# EAGLE design uLipo (EAGLE 7.4.0)
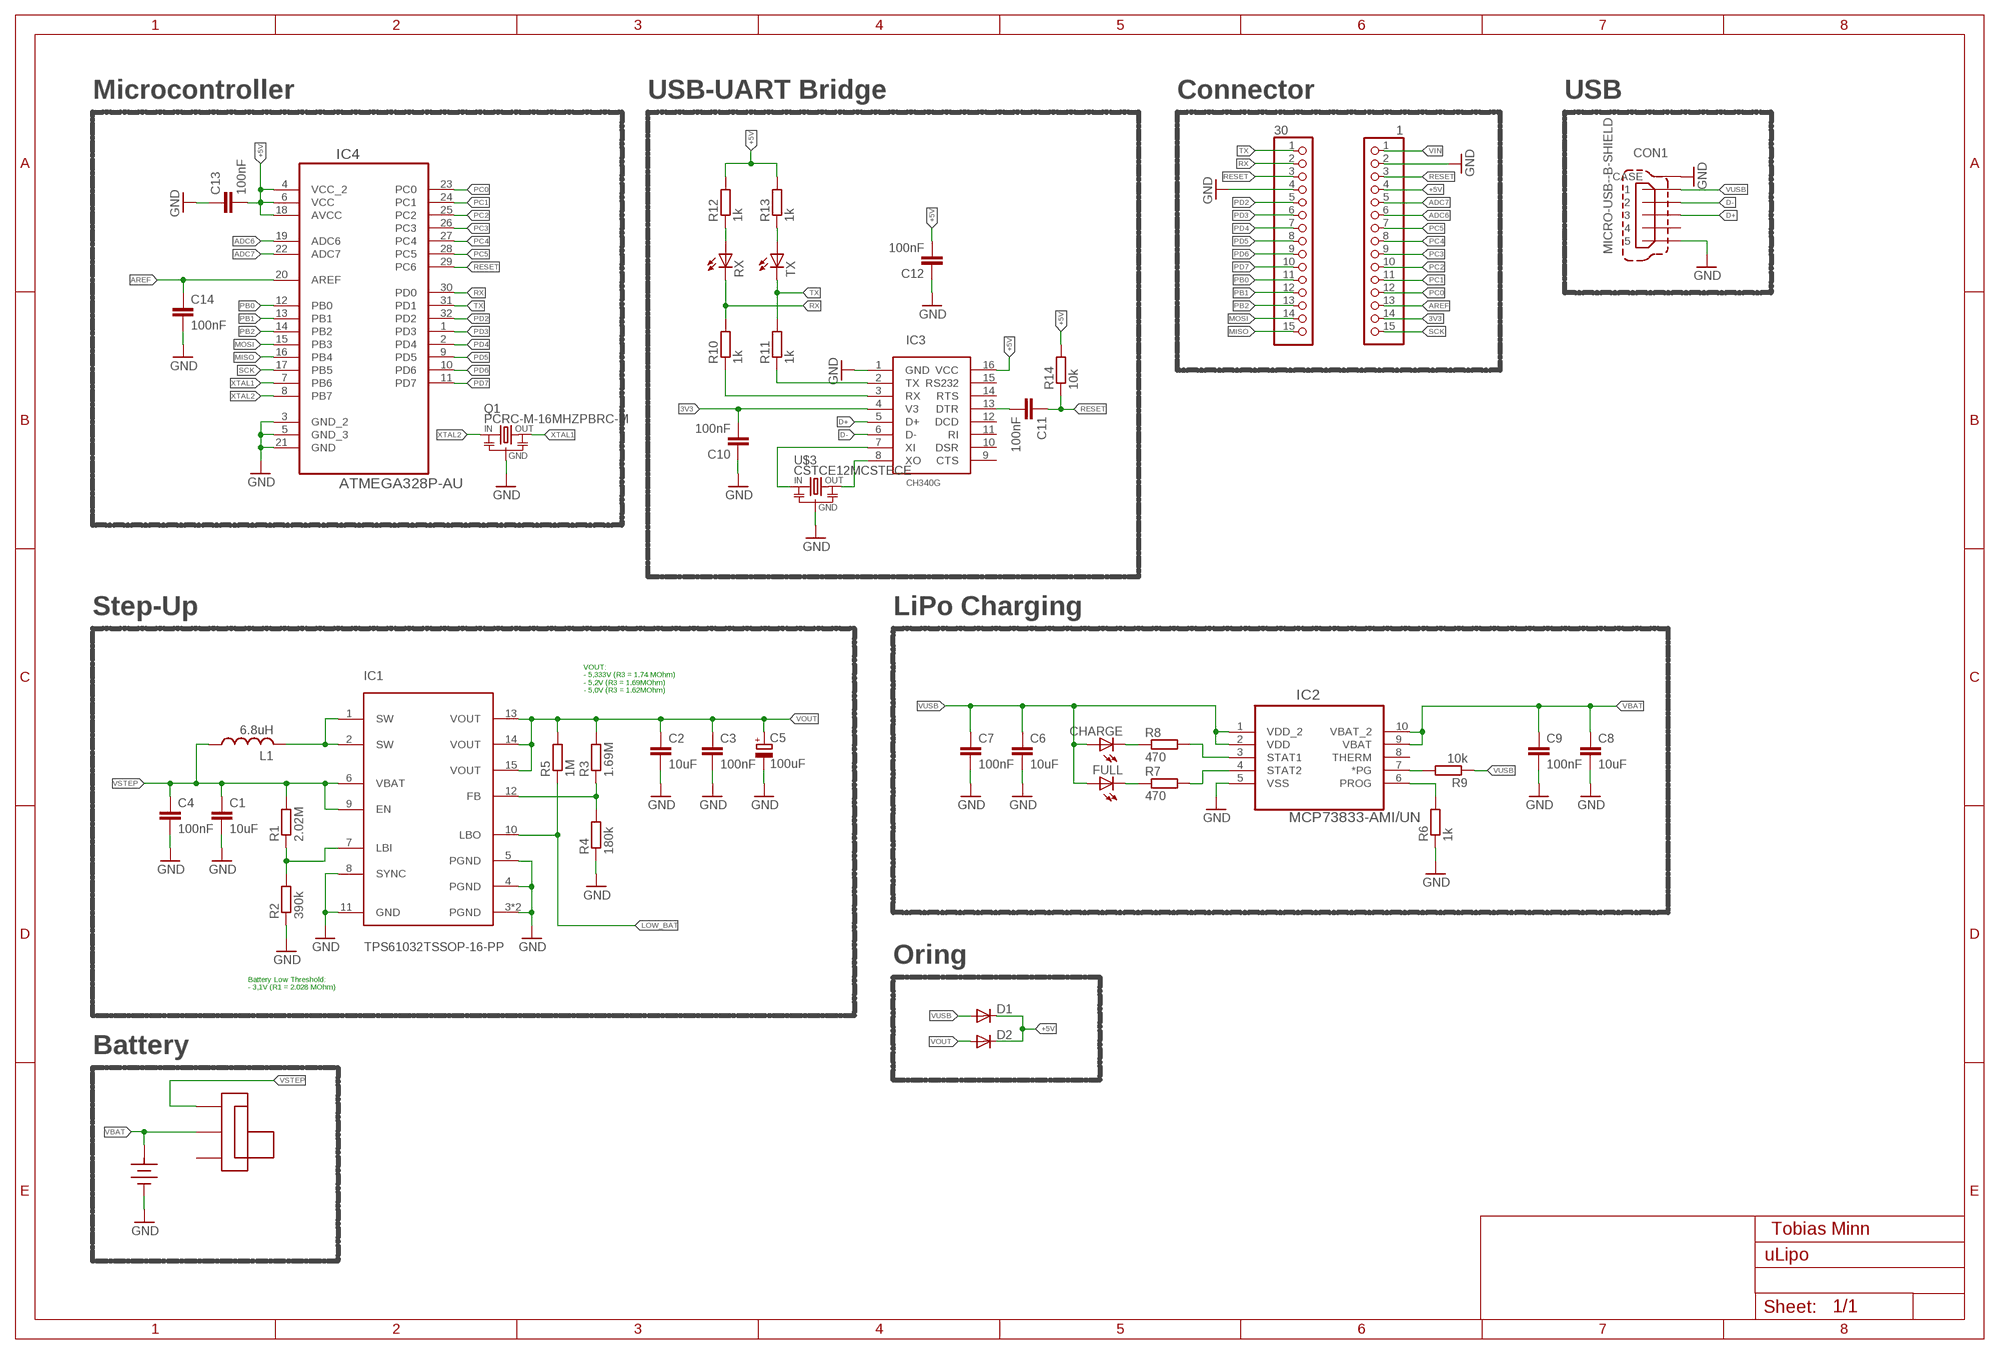
[diagram p0: schematic, sheet 1]

## Parts
1  PINHD-1X15/OCT/BIG  [1X15/OCT/BIG]
30  PINHD-1X15/OCT/BIG  [1X15/OCT/BIG]
BAT  18650BATTERY  [18650BATTERY]
C1  10uF  C-EUC0603K  [C0603K]
C2  10uF  C-EUC0603K  [C0603K]
C3  100nF  C-EUC0603K  [C0603K]
C4  100nF  C-EUC0603K  [C0603K]
C5  100uF  CPOL-EUCT3528  [CT3528]
C6  10uF  C-EUC0603K  [C0603K]
C7  100nF  C-EUC0603K  [C0603K]
C8  10uF  C-EUC0603K  [C0603K]
C9  100nF  C-EUC0603K  [C0603K]
C10  100nF  C-EUC0603K  [C0603K]
C11  100nF  C-EUC0603K  [C0603K]
C12  100nF  C-EUC0603K  [C0603K]
C13  100nF  C-EUC0603K  [C0603K]
C14  100nF  C-EUC0603K  [C0603K]
CHARGE  LEDSML0603  [SML0603]
CON1  MICRO-USB--B-SHIELD  [MOLEX_47346-0001]
D1  DIODE-SOD123  [SOD123]
D2  DIODE-SOD123  [SOD123]
FULL  LEDSML0603  [SML0603]
IC1  TPS61032TSSOP-16-PP  [TSSOP-16-PP]
IC2  MCP73833-AMI/UN  [SOP50P490X110-10N]
IC3  CH340G  [SOIC16]
IC4  ATMEGA328P-AU  [QFP80P900X900X120-32N]
L1  6.8uH  L-USMGV0603  [MGV0603]
Q1  PCRC-M-16MHZPBRC-M  [PBRC-M]
R1  2.02M  R-EU_R0603  [R0603]
R2  390k  R-EU_R0603  [R0603]
R3  1.69M  R-EU_R0603  [R0603]
R4  180k  R-EU_R0603  [R0603]
R5  1M  R-EU_R0603  [R0603]
R6  1k  R-EU_R0603  [R0603]
R7  470  R-EU_R0603  [R0603]
R8  470  R-EU_R0603  [R0603]
R9  10k  R-EU_R0603  [R0603]
R10  1k  R-EU_R0603  [R0603]
R11  1k  R-EU_R0603  [R0603]
R12  1k  R-EU_R0603  [R0603]
R13  1k  R-EU_R0603  [R0603]
R14  10k  R-EU_R0603  [R0603]
RX  LEDCHIP-LED0603  [CHIP-LED0603]
TX  LEDCHIP-LED0603  [CHIP-LED0603]
U$2  SWITCH  [SWITCH]
U$3  CSTCE12MCSTECE  [CSTCE12M]

## Nets
3V3: 1.14 C10.2 IC3.4(V3)
+5V: 1.4 C12.2 C13.2 D1.C D2.C IC3.16(VCC) IC4.4(VCC_2) IC4.6(VCC) IC4.18(AVCC) R12.2 R13.2 R14.2
ADC6: 1.6 IC4.19(ADC6)
ADC7: 1.5 IC4.22(ADC7)
AREF: 1.13 C14.1 IC4.20(AREF)
D+: CON1.3 IC3.5(D+)
D-: CON1.2 IC3.6(D-)
GND: 1.2 30.4 BAT.P$2(P2) C1.2 C2.2 C3.2 C4.2 C5.- C6.2 C7.2 C8.2 C9.2 C10.1 C12.1 C13.1 C14.2 CON1.5 CON1.M1(CASE) CON1.M2(CASE) CON1.M3(CASE) CON1.M4(CASE) CON1.M5(CASE) CON1.M6(CASE) IC1.3(PGND) IC1.4(PGND) IC1.5(PGND) IC1.8(SYNC) IC1.11(GND) IC1.17(PGND) IC2.5(VSS) IC3.1(GND) IC4.3(GND_2) IC4.5(GND_3) IC4.21(GND) Q1.2(GND) R2.1 R4.1 R6.1 U$3.2(GND)
LOW_BAT: IC1.10(LBO) R5.1
MISO: 30.15 IC4.16(PB4)
MOSI: 30.14 IC4.15(PB3)
N$1: IC1.1(SW) IC1.2(SW) L1.P$2
N$2: IC2.4(STAT2) R7.2
N$3: IC1.12(FB) R3.1 R4.2
N$4: IC2.3(STAT1) R8.2
N$5: IC1.7(LBI) R1.1 R2.2
N$6: CHARGE.C R8.1
N$7: FULL.C R7.1
N$8: IC2.7(*PG) R9.2
N$9: IC2.6(PROG) R6.2
N$10: IC3.2(TX) R11.1
N$11: IC3.3(RX) R10.1
N$12: R12.1 RX.A
N$13: R13.1 TX.A
N$14: IC3.7(XI) U$3.1(IN)
N$15: IC3.8(XO) U$3.3(OUT)
N$16: C11.2 IC3.13(DTR)
PB0: 30.11 IC4.12(PB0)
PB1: 30.12 IC4.13(PB1)
PB2: 30.13 IC4.14(PB2)
PC0: 1.12 IC4.23(PC0)
PC1: 1.11 IC4.24(PC1)
PC2: 1.10 IC4.25(PC2)
PC3: 1.9 IC4.26(PC3)
PC4: 1.8 IC4.27(PC4)
PC5: 1.7 IC4.28(PC5)
PD2: 30.5 IC4.32(PD2)
PD3: 30.6 IC4.1(PD3)
PD4: 30.7 IC4.2(PD4)
PD5: 30.8 IC4.9(PD5)
PD6: 30.9 IC4.10(PD6)
PD7: 30.10 IC4.11(PD7)
RESET: 1.3 30.3 C11.1 IC4.29(PC6) R14.1
RX: 30.2 IC4.30(PD0) R10.2 RX.C
SCK: 1.15 IC4.17(PB5)
TX: 30.1 IC4.31(PD1) R11.2 TX.C
VBAT: BAT.P$1(P1) C8.1 C9.1 IC2.9(VBAT) IC2.10(VBAT_2) U$2.P$1
VIN: 1.1
VOUT: C2.1 C3.1 C5.+ D2.A IC1.13(VOUT) IC1.14(VOUT) IC1.15(VOUT) R3.2 R5.2
VSTEP: C1.1 C4.1 IC1.6(VBAT) IC1.9(EN) L1.P$1 R1.2 U$2.P$2
VUSB: C6.1 C7.1 CHARGE.A CON1.1 D1.A FULL.A IC2.1(VDD_2) IC2.2(VDD) R9.1
XTAL1: IC4.7(PB6) Q1.3(OUT)
XTAL2: IC4.8(PB7) Q1.1(IN)
Unconnected: CON1.4 IC2.8(THERM) IC3.9(CTS) IC3.10(DSR) IC3.11(RI) IC3.12(DCD) IC3.14(RTS) IC3.15(RS232) U$2.P$3

## Notes on the sheet
- Microcontroller | USB-UART Bridge | Connector | USB
- Step-Up | LiPo Charging
- VOUT:
  - 5,333V (R3 = 1.74 MOhm)
  - 5,2V (R3 = 1.69MOhm)
  - 5,0V (R3 = 1.62MOhm)
- Oring
- Battery Low Threshold:
  - 3,1V (R1 = 2.028 MOhm)
- Battery
- Tobias Minn

## Library data of the parts
1 30 = pinhead_v2:PINHD-1X15: PIN HEADER
BAT = TM-con:18650BATTERY
C1-C4 C6-C14 = rcl:C-EU: CAPACITOR, European symbol
C5 = rcl:CPOL-EU: POLARIZED CAPACITOR, European symbol
CHARGE FULL RX TX = led:LED: LED OSRAM: - CHIPLED LG R971, LG N971, LY N971, LG Q971, LY Q971, LO R971, LY R971 LH N974, LH R974 LS Q976, LO Q976, LY Q976 LO Q996 - Hyper CHIPLED LW Q18S LB Q993, LB Q99A, LB R99A - SideLED LS A670, LO A670, LY A670, LG A670, LP A670 LB A673, LV A673, LT A673, LW A673 LH A674 LY A675 LS A676, LA A676, LO A676, LY A676, LW A676 LS A679, LY A679, LG A679 - Hyper Micro SIDELED® LS Y876, LA Y876, LO Y876, LY Y876 LT Y87S - SmartLED LW L88C, LW L88S LB L89C, LB L89S, LG L890 LS L89K, LO L89K, LY L89K LS L896, LA L896, LO L896, LY L896 - TOPLED LS T670, LO T670, LY T670, LG T670, LP T670 LSG T670, LSP T670, LSY T670, LOP T670, LYG T670 LG T671, LOG T671, LSG T671 LB T673, LV T673, LT T673, LW T673 LH T674 LS T676, LA T676, LO T676, LY T676, LB T676, LH T676, LSB T676, LW T676 LB T67C, LV T67C, LT T67C, LS T67K, LO T67K, LY T67K, LW E67C LS E67B, LA E67B, LO E67B, LY E67B, LB E67C, LV E67C, LT E67C LW T67C LS T679, LY T679, LG T679 LS T770, LO T770, LY T770, LG T770, LP T770 LB T773, LV T773, LT T773, LW T773 LH T774 LS E675, LA E675, LY E675, LS T675 LS T776, LA T776, LO T776, LY T776, LB T776 LHGB T686 LT T68C, LB T68C - Hyper Mini TOPLED® LB M676 - Mini TOPLED Santana® LG M470 LS M47K, LO M47K, LY M47K Source: http://www.osram.convergy.de LUXEON: - LUMILED® LXK2-PW12-R00, LXK2-PW12-S00, LXK2-PW14-U00, LXK2-PW14-V00 LXK2-PM12-R00, LXK2-PM12-S00, LXK2-PM14-U00 LXK2-PE12-Q00, LXK2-PE12-R00, LXK2-PE12-S00, LXK2-PE14-T00, LXK2-PE14-U00 LXK2-PB12-K00, LXK2-PB12-L00, LXK2-PB12-M00, LXK2-PB14-N00, LXK2-PB14-P00, LXK2-PB14-Q00 LXK2-PR12-L00, LXK2-PR12-M00, LXK2-PR14-Q00, LXK2-PR14-R00 LXK2-PD12-Q00, LXK2-PD12-R00, LXK2-PD12-S00 LXK2-PH12-R00, LXK2-PH12-S00 LXK2-PL12-P00, LXK2-PL12-Q00, LXK2-PL12-R00 Source: www.luxeon.com KINGBRIGHT: KA-3528ASYC Source: www.kingbright.com
CON1 = MK_connector:MICRO-USB-; OC_FARNELL: 1568026; SUPPLIER: MOLEX
D1 D2 = diode:DIODE-: DIODE
IC1 = TM-power:TPS61032
IC2 = TM-power:MCP73833-AMI/UN: IC, BATTERY CHARGER, 1A; MPN: MCP73833-AMI/UN; OC_FARNELL: 1332160; OC_NEWARK: 88K5664; PACKAGE: MSOP-10; SUPPLIER: Microchip
IC3 = TM-misc:CH340G
IC4 = AtmelMC:ATMEGA328P-AU: 8-bit Microcontroller with In-System Programmable Flash; MPN: ATMEGA328P-AU; OC_FARNELL: 1715486; OC_NEWARK: 14R4631; PACKAGE: TQFP-32; SUPPLIER: Atmel
L1 = TM-passives:L-US: INDUCTOR, American symbol
Q1 = TM-misc:PCRC-M-16MHZ
R1-R14 = rcl:R-EU_: RESISTOR, European symbol
U$2 = TM-misc:SWITCH
U$3 = TM-misc:CSTCE12M

## Board
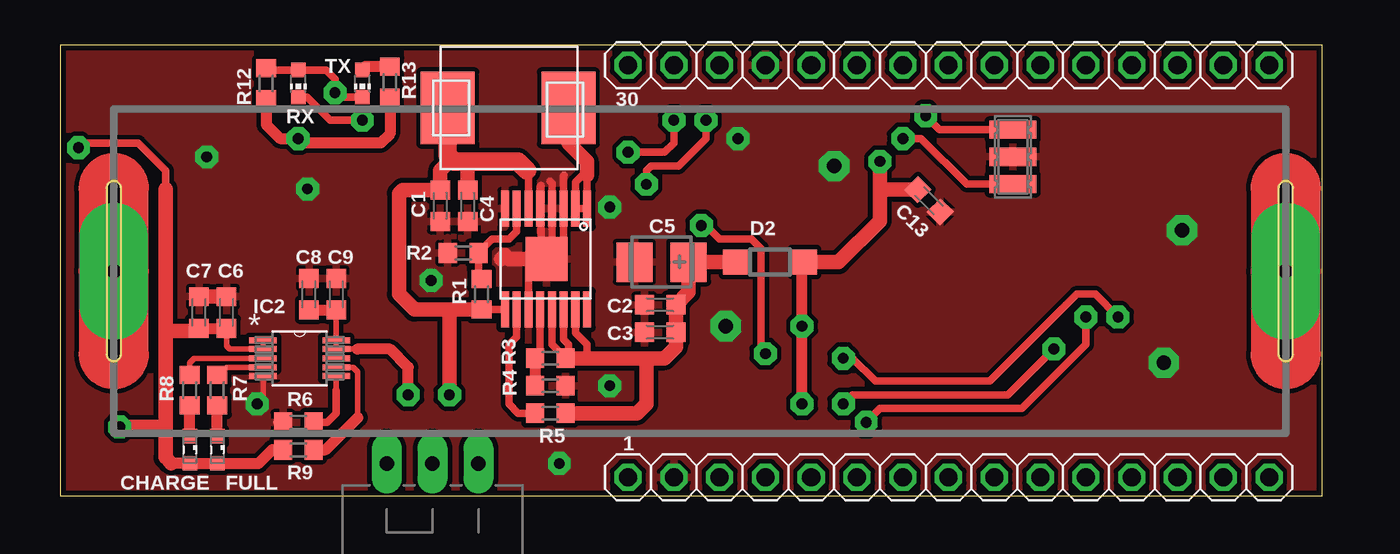
[diagram p1: board, top side]
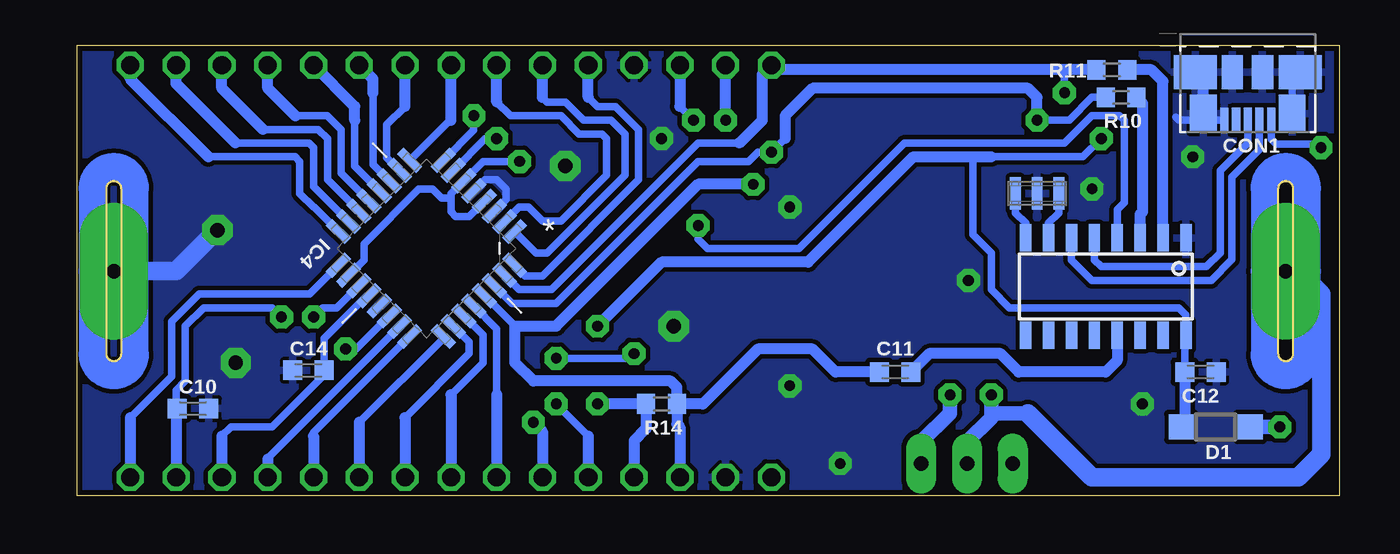
[diagram p2: board, bottom side, seen from below]

Size 70 x 25 mm. Coordinates in mm from the lower left corner, seen from the top.
Outline: 0,0 70,0 70,25 0,25 0,0
Copper layers (1*16): Top 0.035mm / dielectric 1.5mm / Bottom 0.035mm
Design rules "PCB-POOL Standard_editM": minimum track width 0.15mm, minimum drill 0.3mm, track to track 0.15mm, track to pad 0.15mm, pad to pad 0.15mm, via to via 0.15mm, smd to smd 0.15mm, copper to edge 0.3mm, drill to drill 0.2mm, minimum pad ring 0.2mm, minimum via ring 0.15mm, stop-mask expansion 0.075mm, vias tented up to drill 0mil, thermal gap 0.2mm

### Footprints (pad centres in the part's own frame; a part is rotated, then mirrored left to right if it is on the bottom)
1X15/OCT/BIG = drill 1 pad 1.5 octagon: 1 -17.78,0; 2 -15.24,0; 3 -12.7,0; 4 -10.16,0; 5 -7.62,0; 6 -5.08,0; 7 -2.54,0; 8 0,0; 9 2.54,0; 10 5.08,0; 11 7.62,0; 12 10.16,0; 13 12.7,0; 14 15.24,0; 15 17.78,0
18650BATTERY = drill 0.8 pad 3.81 long: P$1 0,0; P$2 65,0
C0603K = smd 1.05 x 1.08: 1 -0.875,0; 2 0.875,0
CT3528 = smd 2 x 2.2: + -1.5,0; - 1.5,0
SML0603 = smd 0.8 x 0.8: A 0.75,0; C -0.75,0
MOLEX_47346-0001 = smd 0.45 x 1.38: 1 -1.3,0; 2 -0.65,0; 3 0,0; 4 0.65,0; 5 1.3,0 | smd 1.475 x 2.1: M1 -2.462,-0.36; M2 2.462,-0.36 | smd 2.375 x 1.9: M3 -2.913,-2.66; M6 2.913,-2.66 | smd 1.175 x 1.9: M4 -0.82,-2.66; M5 0.85,-2.66
SOD123 = smd 1.4 x 1.4: A 1.9,0; C -1.9,0
TSSOP-16-PP = smd 0.45 x 2: 1 -2.3,-2.8; 2 -1.65,-2.8; 3 -1,-2.8; 4 -0.35,-2.8; 5 0.3,-2.8; 6 0.95,-2.8; 7 1.6,-2.8; 8 2.25,-2.8; 9 2.25,2.8; 10 1.6,2.8; 11 0.95,2.8; 12 0.3,2.8; 13 -0.35,2.8; 14 -1,2.8; 15 -1.65,2.8; 16 -2.3,2.8 | smd 2.31 x 2.46: 17 -0.05,0
SOP50P490X110-10N = smd 1.524 x 0.33: 1 -2.032,0.991; 2 -2.032,0.508; 3 -2.032,0; 4 -2.032,-0.508; 5 -2.032,-0.991; 6 2.032,-0.991; 7 2.032,-0.508; 8 2.032,0; 9 2.032,0.508; 10 2.032,0.991
SOIC16 = smd 0.635 x 1.524: 1 -4.445,-2.695; 2 -3.175,-2.695; 3 -1.905,-2.695; 4 -0.635,-2.695; 5 0.635,-2.695; 6 1.905,-2.695; 7 3.175,-2.695; 8 4.445,-2.695; 9 4.445,2.695; 10 3.175,2.695; 11 1.905,2.695; 12 0.635,2.695; 13 -0.635,2.695; 14 -1.905,2.695; 15 -3.175,2.695; 16 -4.445,2.695
QFP80P900X900X120-32N = smd 1.473 x 0.508: 1 -4.115,2.794; 2 -4.115,2.007; 3 -4.115,1.194; 4 -4.115,0.406; 5 -4.115,-0.406; 6 -4.115,-1.194; 7 -4.115,-2.007; 8 -4.115,-2.794; 17 4.115,-2.794; 18 4.115,-2.007; 19 4.115,-1.194; 20 4.115,-0.406; 21 4.115,0.406; 22 4.115,1.194; 23 4.115,2.007; 24 4.115,2.794 | smd 0.508 x 1.473: 9 -2.794,-4.115; 10 -2.007,-4.115; 11 -1.194,-4.115; 12 -0.406,-4.115; 13 0.406,-4.115; 14 1.194,-4.115; 15 2.007,-4.115; 16 2.794,-4.115; 25 2.794,4.115; 26 2.007,4.115; 27 1.194,4.115; 28 0.406,4.115; 29 -0.406,4.115; 30 -1.194,4.115; 31 -2.007,4.115; 32 -2.794,4.115
MGV0603 = smd 3 x 4: P$1 -3.4,0; P$2 3.3,0
PBRC-M = smd 1 x 2.6: 1 -1.5,0; 2 0,0; 3 1.5,0
R0603 = smd 1 x 1.1: 1 -0.85,0; 2 0.85,0
CHIP-LED0603 = smd 0.8 x 0.8: A 0,-0.75; C 0,0.75
SWITCH = drill 0.8 pad 1.676 long: P$1 0,0; P$2 -2.54,0; P$3 2.54,0
CSTCE12M = smd 0.6 x 1.8: 1 -1.2,0; 2 0,0; 3 1.2,0

### Placement (x,y rotation side)
1  49.27,1.02 0 top
30  49.27,23.88 0 top
BAT  2.97,12.45 0 top
C1  21.07,16.08 270 top
C2  33.27,10.59 180 top
C3  33.27,9.06 180 top
C4  22.6,16.08 270 top
C5  33.35,12.95 180 top
C6  9.22,10.16 90 top
C7  7.69,10.16 90 top
C8  13.79,11.18 90 top
C9  15.31,11.18 90 top
C10  63.57,4.83 180 bottom
C11  24.63,6.86 0 bottom
C12  7.69,6.86 180 bottom
C13  48.18,16.36 135 top
C14  57.17,6.95 180 bottom
CHARGE  7.18,2.54 270 top
CON1  5.07,20.83 180 bottom
D1  6.85,3.81 0 bottom
D2  39.36,12.95 180 top
FULL  8.71,2.54 270 top
IC1  26.92,13.13 180 top
IC2  13.28,7.62 0 top
IC3  12.95,11.6 180 bottom
IC4  50.62,13.72 225 bottom
L1  24.88,21.51 0 top
Q1  52.82,18.8 270 top
R1  23.36,11.18 270 top
R2  22.34,13.46 0 top
R3  27.17,7.62 0 top
R4  27.17,6.1 180 top
R5  27.17,4.57 0 top
R6  13.2,4.06 0 top
R7  8.71,5.84 90 top
R8  7.18,5.84 90 top
R9  13.2,2.54 0 top
R10  12.1,22.1 180 bottom
R11  12.61,23.62 180 bottom
R12  11.42,22.86 270 top
R13  18.28,22.94 270 top
R14  37.58,5.08 180 bottom
RX  13.2,22.86 180 top
TX  16.76,22.86 180 top
U$2  20.65,1.78 180 top
U$3  16.76,16.76 180 bottom

### Tracks (layer width: path | path; a pad name or v marks a point on that pad's centre or on a via)
3V3  (via drill 0.6 pad 1.27)
  Top 0.406: v35.55,14.99 35.81,14.99 36.57,14.22 38.35,14.22 38.85,13.72 38.85,8.13 v39.11,7.87 | v43.43,7.62 43.93,7.62 45.2,6.35 51.55,6.35 56.38,11.18 57.4,11.18 v58.67,9.91
  Bottom 0.406: v35.55,14.99 35.55,14.22 35.04,13.72 29.96,13.72 24.12,19.56 15.23,19.56 13.71,21.08 12.18,21.08 11.93,20.83 11.93,16.26 12.31,15.88 IC3.4 | v39.11,7.87 39.36,7.62 v43.43,7.62 | v58.67,9.91 59.17,10.41 62.98,10.41 64,9.4 64,6.35 64.51,5.84 64.51,4.89 C10.2
  Bottom 0.61: C10.2 64.51,4.76 1.14
+5V  (via drill 0.6 pad 1.27)
  Top 0.61: D2.C 41.14,12.83 v41.14,9.4 v41.14,5.08 | R12.2 11.42,20.57 12.18,19.81 v13.2,19.81 13.45,19.56 17.77,19.56 18.28,20.07 R13.2
  Top 0.813: D2.C 43.17,12.95 45.46,15.24 45.46,16.76 | 45.46,16.76 v45.46,18.54 | 45.46,16.76 45.67,16.97 C13.2
  Bottom 0.406: 49.27,16.51 49.27,16.75 IC4.6 47.49,18.54 v45.46,18.54 | 49.27,16.51 49.27,15.75 49.01,15.49 48.27,15.49 IC4.4 | IC4.18 54.09,13.08 54.09,13.97 51.05,17.02 50.28,17.02 49.78,16.51 49.27,16.51 | C12.2 8.57,8.84 IC3.16 8.5,10.03 8.88,10.41 18.28,10.41 19.3,11.43 19.3,13.46 20.31,14.48 20.31,18.8 | v13.2,19.81 14.22,18.8 19.3,18.8
  Bottom 0.61: C12.2 8.57,3.88 8.68,3.88 D1.C | v41.14,5.08 R14.2 38.43,3.72 39.11,3.05 1.4 | v41.14,9.4 37.58,12.95 29.46,12.95 23.61,18.8 20.31,18.8 19.3,18.8
ADC6  (via drill 0.6 pad 1.27)
  Top 0.406: v56.89,9.91 56.89,8.38 53.33,4.83 45.46,4.83 v44.7,4.06
  Bottom 0.406: IC4.19 55.61,10.41 56.38,10.41 v56.89,9.91
  Bottom 0.61: v44.7,4.06 44.19,3.56 1.6
ADC7  (via drill 0.6 pad 1.27)
  Top 0.406: v55.11,8.13 52.57,5.59 43.93,5.59 v43.43,5.08
  Bottom 0.406: IC4.22 54.52,8.13 v55.11,8.13 | 41.65,3.3 v43.43,5.08
  Bottom 0.61: 41.65,3.3 1.5
AREF
  Bottom 0.406: 61.97,3.3 61.46,3.81 59.17,3.81 56.29,6.69 C14.1 56.29,8.72 53.92,11.09 IC4.20
  Bottom 0.61: 61.97,3.3 1.13
D+
  Bottom 0.406: CON1.3 5.07,19.56 6.6,18.03 6.6,13.46 7.36,12.7 13.2,12.7 13.58,13.08 IC3.5
D-
  Bottom 0.406: CON1.2 4.42,19.19 5.95,17.67 5.95,13.1 7.1,11.94 13.71,11.94 14.85,13.08 IC3.6
GND  (via drill 0.6 pad 1.27, 0.8 pad 1.68)
  Top 0.305: IC2.5 11.25,5.41 v10.91,5.08
  Top 0.406: 27.27,13.13 IC1.17 | 27.92,13.13 IC1.17 | 26.62,13.13 IC1.17 | 24.67,13.35 24.88,13.13 | 12.01,4.06 R6.1 | IC1.11 25.97,12.69 26.41,13.13 | 27.17,17.45 27.27,17.35 IC1.4 27.27,13.43 IC1.17 | IC1.5 26.62,17.15 26.66,17.19 26.66,13.43 IC1.17 | IC1.17 27.92,14.08 27.92,15.99 27.93,16 | IC1.3 27.92,17.76 27.93,17.78
  Top 0.813: 24.88,13.13 26.41,13.13 IC1.17 | 24.45,13.13 24.67,13.35 | C6.2 C7.2
  Bottom 0.406: IC4.5 47.38,17.53 46.73,17.53 46.22,17.02 46.22,16.43 IC4.3 | CON1.5 8.88,20.83 9.06,21 | CON1.M1 2.61,23.04 CON1.M3
  Bottom 0.61: CON1.M2 7.54,23.04 CON1.M6
  Bottom 1.016: BAT.P$2 64.5,12.45 v62.22,14.73
  other vias: 36.9,9.4 61.21,7.37 42.92,18.29 8.12,18.8 27.68,1.78 20.57,11.94 30.47,6.1 30.47,16 37.58,19.81 13.71,17.02
  pour Bottom (isolate 0.254): 70,0 0,0 0,25 70,25
  pour Top (isolate 0.254): 0,0 70,0 70,25 0,25
LOW_BAT
  Top 0.406: IC1.10 25.32,8.81 24.88,8.38 24.88,5.08 25.39,4.57 R5.1
MISO
  Bottom 0.406: IC4.16 56.85,16 56.89,16 57.65,16.76 57.65,18.54 57.9,18.8 62.73,18.8
  Bottom 0.61: 62.73,18.8 67.05,23.11 30.15
MOSI
  Bottom 0.406: IC4.15 56.89,17.15 56.89,19.3 57.14,19.56 61.21,19.56
  Bottom 0.61: 61.21,19.56 64.51,22.86 30.14
N$1
  Top 0.406: 29.2,17.78 29.22,17.77 IC1.1 IC1.2 28.57,17.4 29.2,18.03
  Top 0.813: L1.P$2 28.18,19.56 29.2,18.54 29.2,18.03 29.2,17.78
N$2
  Top 0.305: IC2.4 9.22,7.11 8.96,6.86 8.87,6.86 R7.2
N$3
  Top 0.406: 26.11,7.83 R3.1 26.62,7.92 IC1.12
  Top 0.61: R3.1 R4.2
N$4
  Top 0.305: IC2.3 7.44,7.62 7.18,7.37 R8.2
N$5
  Top 0.406: IC1.7 25.32,14.66 24.88,14.22 23.96,14.22 R2.2 23.19,12.19 R1.1
N$6
  Top 0.61: CHARGE.C R8.1
N$7
  Top 0.61: FULL.C R7.1
N$8
  Top 0.305: IC2.7 16.25,7.11 16.5,6.86 16.5,4.32
  Top 0.61: R9.2 14.72,2.54 16.5,4.32
N$9
  Top 0.305: IC2.6 15.31,5.84
  Top 0.406: 15.31,5.84 15.31,4.57 14.8,4.06 R6.2
N$10
  Bottom 0.61: IC3.2 9.77,22.99 10.41,23.62 R11.1
N$11
  Bottom 0.61: 11.17,22.1 R10.1 10.91,21.76 10.91,15.75 11.04,15.62 IC3.3
N$12
  Top 0.406: 15.23,22.35 15.23,23.11 14.74,23.61 RX.A 11.52,23.61 R12.1
N$13
  Top 0.61: R13.1 16.86,23.79 16.76,23.69 TX.A
N$14
  Bottom 0.406: IC3.7 16.12,15.11 15.56,15.68 U$3.1
N$15
  Bottom 0.406: IC3.8 17.39,15.11 17.96,15.68 U$3.3
N$16
  Bottom 0.61: IC3.13 12.31,7.49 12.95,6.86 17.77,6.86 18.79,7.87 22.74,7.87 C11.2
PB0
  Bottom 0.406: IC4.12 54.61,18.29 54.6,18.3 54.6,20.83
  Bottom 0.61: 54.6,20.83 54.6,21.59 30.11
PB1
  Bottom 0.406: 57.9,21.08 56.13,21.08 55.36,20.32 55.36,17.89 IC4.13
  Bottom 0.61: 57.9,21.08 59.43,22.61 30.12
PB2
  Bottom 0.406: IC4.14 56.12,17.53 56.12,19.8 56.63,20.32 59.68,20.32
  Bottom 0.61: 59.68,20.32 61.97,22.61 30.13
PC0
  Bottom 0.406: IC4.23 59.43,2.07 59.43,2.03
  Bottom 0.61: 59.43,2.03 1.12
PC1
  Bottom 0.406: IC4.24 56.89,3.5 56.89,3.3
  Bottom 0.61: 56.89,3.3 1.11
PC2
  Bottom 0.406: IC4.25 49.68,8.73 54.35,4.06
  Bottom 0.61: 54.35,4.06 1.10
PC3
  Bottom 0.406: IC4.26 48.25,8.51 48.25,7.87 51.81,4.32
  Bottom 0.61: 51.81,4.32 1.9
PC4
  Bottom 0.406: IC4.27 47.49,8.9 47.49,7.37 49.27,5.59
  Bottom 0.61: 49.27,5.59 1.8
PC5
  Bottom 0.406: 46.73,5.59 46.73,9.25 IC4.28
  Bottom 0.61: 46.73,5.59 1.7
PD2
  Bottom 0.406: IC4.32 45.14,12.19 44.19,12.19 38.85,17.53 38.85,20.32 40.12,21.59 41.14,21.59 41.65,22.1
  Bottom 0.61: 41.65,22.1 30.5
PD3
  Bottom 0.406: IC4.1 44.54,13.46 43.93,13.46 39.62,17.78 39.62,20.07 40.38,20.83 41.9,20.83 42.92,21.84 43.93,21.84 44.19,22.1
  Bottom 0.61: 44.19,22.1 30.6
PD4
  Bottom 0.406: IC4.2 45.49,16 44.95,16 44.19,15.24 43.17,15.24 40.63,17.78 40.63,19.81 40.89,20.07 42.16,20.07 43.17,21.08 45.97,21.08 46.73,21.84
  Bottom 0.61: 46.73,21.84 30.7
PD5
  Bottom 0.406: IC4.9 49.32,20.83 49.27,20.83
  Bottom 0.61: 49.27,20.83 30.8
PD6
  Bottom 0.406: IC4.10 52.82,18.76 52.82,20.57 51.81,21.59
  Bottom 0.61: 51.81,21.59 30.9
PD7
  Bottom 0.406: IC4.11 53.59,18.37 53.59,22.35
  Bottom 0.61: 53.59,22.35 53.59,23.11 30.10
RESET  (via drill 0.6 pad 1.27)
  Top 0.406: v32.5,17.27 32.5,18.03 32.76,18.29 34.28,18.29 35.81,19.81 v35.81,20.83
  Bottom 0.406: 36.57,21.59 v35.81,20.83 | IC4.29 47.41,11.09 45.71,9.4
  Bottom 0.61: 36.57,4.91 R14.1 | R14.1 36.73,6.01 37.08,6.35 44.7,6.35 45.71,7.37 45.71,9.4 43.43,9.4 35.55,17.27 v32.5,17.27 | C11.1 27.93,6.86 29.2,8.13 32.25,8.13 35.3,5.08 R14.1 | R14.1 36.73,3.98 36.57,3.81 1.3 | 30.3 36.57,21.59
RX  (via drill 0.6 pad 1.27)
  Top 0.406: v31.49,19.05 33.52,19.05 34.03,19.56 v34.03,20.83 | v16.76,20.83 14.98,20.83 13.7,22.11 RX.C
  Bottom 0.406: IC4.30 45.88,10.67 43.43,10.67 35.55,18.54 32.76,18.54 32.25,19.05 v31.49,19.05 30.73,19.81 | R10.2 13.71,22.1 14.98,20.83 v16.76,20.83
  Bottom 0.61: v16.76,20.83 16.76,22.1 17.26,22.61 29.2,22.61 30.73,21.08 30.73,19.81 | v34.03,20.83 30.2
SCK
  Bottom 0.406: IC4.17 57.11,11.18 63.24,11.18 64.76,9.65 64.76,6.6 67.05,4.32
  Bottom 0.61: 67.05,4.32 1.15
TX  (via drill 0.6 pad 1.27)
  Top 0.406: TX.C 15.47,22.11 v15.23,22.35
  Bottom 0.406: IC4.31 45.49,11.43 43.68,11.43 35.55,19.56 33.27,19.56 | v15.23,22.35 15.23,23.62
  Bottom 0.61: R11.2 15.23,23.62 31.23,23.62 30.1 32,23.37 32,20.83 33.27,19.56
VBAT  (via drill 0.6 pad 1.27)
  Top 0.305: 16.47,8.13 IC2.9 IC2.10 C9.1
  Top 0.61: C8.1 C9.1 | v19.3,5.59 19.3,7.11 18.28,8.13 16.47,8.13
  Bottom 0.813: v19.3,5.59 19.3,4.57 | 19.3,4.57 19.3,4.32 20.65,2.97 U$2.P$1 | 17.26,4.57 19.3,4.57
  Bottom 1.016: 17.26,4.57 13.71,1.02 2.28,1.02 1.01,2.29 1.01,11.18 2.29,12.45 BAT.P$1
VOUT
  Top 0.406: IC1.13 27.27,8.37 R3.2 28.19,7.79 28.19,8.38 27.92,8.65 IC1.14 | IC1.15 28.57,9.02 29.2,8.38 29.2,7.62
  Top 0.813: R3.2 29.2,7.62 32.76,7.62 | 32.76,7.62 33.52,7.62 34.14,8.24 C3.1 C2.1 34.85,11.29 C5.+ D2.A | R5.2 32,4.57 32.5,5.08 32.5,7.37 32.76,7.62
VSTEP  (via drill 0.6 pad 1.27)
  Top 0.406: IC1.6 25.97,17.97 25.9,18.03 | IC1.9 R1.2
  Top 0.813: 21.71,18.67 21.07,18.03 C1.1 18.98,16.96 18.79,16.76 18.79,11.18 19.64,10.33 21.58,10.33 | C4.1 22.6,18.54 | R1.2 21.58,10.33 | v21.58,5.59 21.58,10.33
  Top 1.016: 25.9,18.03 25.39,18.54 22.6,18.54 21.84,18.54 21.71,18.67 21.48,18.89 L1.P$1
  Bottom 0.813: U$2.P$2 23.19,2.97 21.58,4.57 v21.58,5.59
VUSB  (via drill 0.6 pad 1.27)
  Top 0.305: IC2.1 IC2.2 9.39,8.13 9.22,8.3 C6.1
  Top 0.406: v1.01,19.3 1.26,19.56 4.31,19.56 5.83,18.03 5.83,17.02
  Top 0.61: 6.16,1.79 CHARGE.A FULL.A 8.72,1.78 10.99,1.78 11.76,2.54 R9.1 | C7.1 C6.1
  Top 0.813: 5.83,4.06 5.83,2.11 6.16,1.79 | v3.29,3.81 5.58,3.81 5.83,4.06 | 5.83,4.06 5.83,9.14 | 5.83,9.14 5.83,17.02 | C7.1 7.55,9.14 5.83,9.14
  Bottom 0.406: CON1.1 3.77,19.77 3.5,19.5 1.2,19.5 v1.01,19.3
  Bottom 0.813: D1.A v3.29,3.81
XTAL1  (via drill 0.6 pad 1.27)
  Top 0.406: v46.73,19.81 47.74,19.81 50.28,17.27 52.8,17.27 Q1.3
  Bottom 0.406: IC4.7 47.36,19.81 v46.73,19.81
XTAL2  (via drill 0.6 pad 1.27)
  Top 0.406: v48,21.08 48.76,20.32 49.01,20.32 49.04,20.3 Q1.1
  Bottom 0.406: IC4.8 48,20.29 v48,21.08